# Altium schematic sheet Buzzer.SchDoc: Top Level
size A3; CompanyName: NOT USED; DocumentNumber: 4; SheetNumber: 4; SheetTotal: 10; PageSetup: Record=PageOptions|CenterHorizontal=True|CenterVertical=True|PrintScale=1.00|XCorrection=1.00|YCorrection=1.00|PrintKind=0|BorderSize=5000000|LeftOffset=0|BottomOffset=0|Orientation=2|PaperLength=1000|PaperWidth=1000|Scale=100|PaperSource=7|PrintQuality=-4|MediaType=1|DitherType=10|PaperKind=A3|PrintScaleMode=0
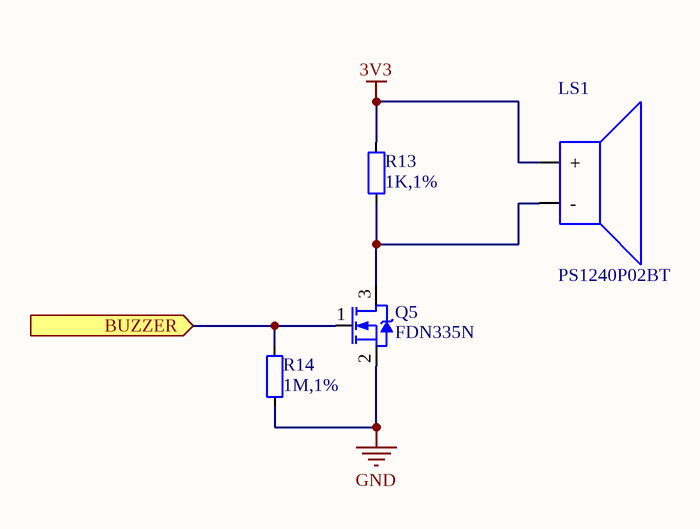
[diagram p0: Buzzer.SchDoc]

## Parts
LS1  PS1240P02BT  [SPKR_PS1240P02BT]
Q5  FDN335N  [SOT95P230X110-3N_SOT23]
R13  1K,1%  [RESC1608X06N_0603]
R14  1M,1%  [RESC1608X06N_0603]

## Ports
BUZZER (in)

## Nets
3V3: LS1.1(+) R13.2
GND: Q5.2(S) R14.2
BUZZER: Q5.1(G) R14.1 ; port BUZZER
NetLS1_2: LS1.2(-) Q5.3(D) R13.1

## Notes on the sheet
- Project
- Size:
- Date:
- A3
- Revision:
- Sheet
- of
- Lambo
- File:

## Library data of the parts
LS1 = SPK-10003-A: BUZZER PIEZO 4KHZ 12.2MM PC MNT; Manufacturer: TDK Corporation; SPL: 70dB; Display_Name: PS1240P02BT; Size: 12.2mmDiax6.5H; BWA PN: SPK-10003-A; Frequency Range: 4kHz; Schematic Symbol: SPEAKER_1; Manufacturer Part Number: PS1240P02BT; Supplier 1: Digi-Key; Supplier Part Number 1: 445-2525-1-ND
Q5 = TRN-10045-A: MOSFET N-CH 20V 1.7A SSOT3; Manufacturer: Fairchild Semiconductor; Type: N; rds(on): 70mOhm; Vgs(max): +/-8V; Vth(max): 1.5V; Display_Name: FDN335N; BWA PN: TRN-10045-A; Id(max): 1.7A; Vds(max): 20V; Schematic Symbol: MOSFET-N_1; Manufacturer Part Number: FDN335N; Supplier 1: Digi-Key; Supplier Part Number 1: FDN335NCT-ND
R13 = RSH-1K000-D: RES 1.00K OHM 1/10W 1% 0603 SMD; Manufacturer: Yageo; Manufacturer Part Number: RC0603FR-071KL; Power: 0.1W; Display_Name: 1K,1%; Resistance: 1K; Tolerance: 1%; Type: Chip; BWA PN: RSH-1K000-D; Schematic Symbol: RESISTOR_1; Supplier 1: Digi-Key; Supplier Part Number 1: 311-1.00KHRCT-ND
R14 = RSH-1M000-D: RES 1.00M OHM 1/10W 1% 0603 SMD; Manufacturer: Yageo; Manufacturer Part Number: RC0603FR-071ML; Power: 0.1W; Display_Name: 1M,1%; Resistance: 1M; Tolerance: 1%; Type: Chip; BWA PN: RSH-1M000-D; Schematic Symbol: RESISTOR_1; Supplier 1: Digi-Key; Supplier Part Number 1: 311-1.00MHRCT-ND